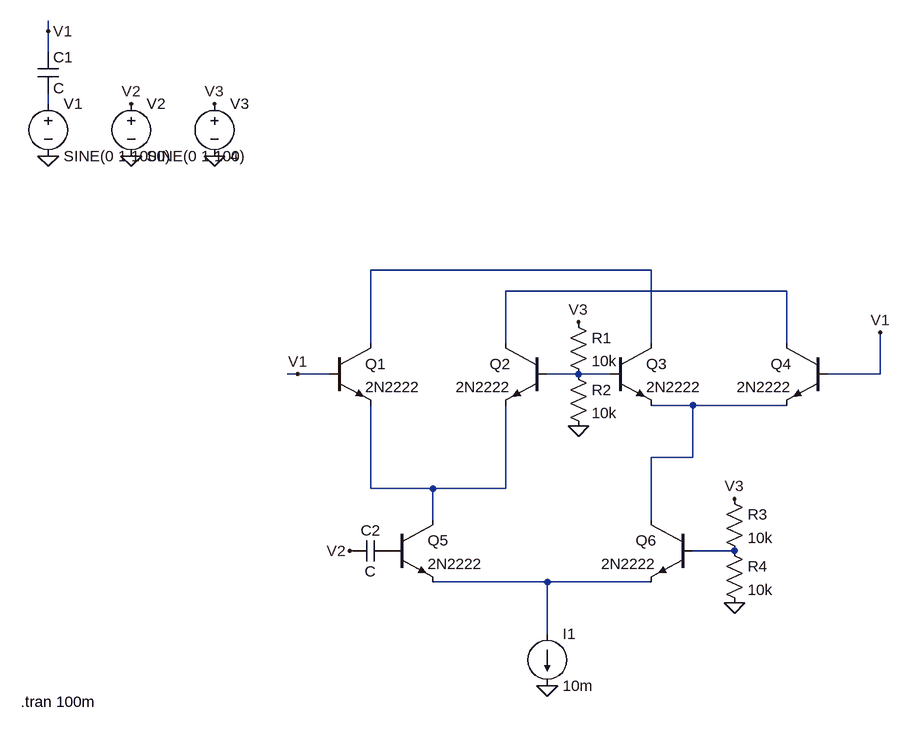
[diagram p0: schematic Draft3.asc]
Draft3.asc, the LTspice schematic file:
Version 4
SHEET 1 880 680
WIRE -432 -368 -432 -384
WIRE -432 -336 -432 -368
WIRE -432 -256 -432 -272
WIRE 496 0 64 0
WIRE 704 32 272 32
WIRE 64 112 64 0
WIRE 272 112 272 32
WIRE 496 112 496 0
WIRE 704 112 704 32
WIRE -48 160 -64 160
WIRE 0 160 -48 160
WIRE 384 160 336 160
WIRE 432 160 384 160
WIRE 848 160 848 96
WIRE 848 160 768 160
WIRE 560 208 496 208
WIRE 704 208 560 208
WIRE 560 288 560 208
WIRE 560 288 496 288
WIRE 64 336 64 208
WIRE 160 336 64 336
WIRE 272 336 272 208
WIRE 272 336 160 336
WIRE 160 384 160 336
WIRE 496 384 496 288
WIRE 624 432 560 432
WIRE 336 480 160 480
WIRE 496 480 336 480
WIRE 336 560 336 480
FLAG -432 -176 0
FLAG -304 -176 0
FLAG -176 -176 0
FLAG -304 -256 V2
FLAG 384 240 0
FLAG -176 -256 V3
FLAG 384 80 V3
FLAG 624 512 0
FLAG 624 352 V3
FLAG 32 432 V2
FLAG 336 640 0
FLAG -432 -368 V1
FLAG -48 160 V1
FLAG 848 96 V1
SYMBOL npn 0 112 R0
SYMATTR InstName Q1
SYMATTR Value 2N2222
SYMBOL npn 336 112 M0
SYMATTR InstName Q2
SYMATTR Value 2N2222
SYMBOL npn 432 112 R0
SYMATTR InstName Q3
SYMATTR Value 2N2222
SYMBOL npn 768 112 M0
SYMATTR InstName Q4
SYMATTR Value 2N2222
SYMBOL npn 96 384 R0
SYMATTR InstName Q5
SYMATTR Value 2N2222
SYMBOL npn 560 384 M0
SYMATTR InstName Q6
SYMATTR Value 2N2222
SYMBOL voltage -432 -272 R0
WINDOW 123 0 0 Left 0
WINDOW 39 0 0 Left 0
SYMATTR InstName V1
SYMATTR Value SINE(0 1 1000)
SYMBOL voltage -304 -272 R0
WINDOW 123 0 0 Left 0
WINDOW 39 0 0 Left 0
SYMATTR InstName V2
SYMATTR Value SINE(0 1 100)
SYMBOL voltage -176 -272 R0
WINDOW 123 0 0 Left 0
WINDOW 39 0 0 Left 0
SYMATTR InstName V3
SYMATTR Value 4
SYMBOL res 368 64 R0
SYMATTR InstName R1
SYMATTR Value 10k
SYMBOL res 368 144 R0
SYMATTR InstName R2
SYMATTR Value 10k
SYMBOL res 608 336 R0
SYMATTR InstName R3
SYMATTR Value 10k
SYMBOL res 608 416 R0
SYMATTR InstName R4
SYMATTR Value 10k
SYMBOL cap 96 416 R90
WINDOW 0 0 32 VBottom 2
WINDOW 3 32 32 VTop 2
SYMATTR InstName C2
SYMBOL current 336 560 R0
WINDOW 123 0 0 Left 0
WINDOW 39 0 0 Left 0
SYMATTR InstName I1
SYMATTR Value 10m
SYMBOL cap -448 -336 R0
SYMATTR InstName C1
TEXT -474 664 Left 2 !.tran 100m

The netlist it stands for:
* Draft3.asc
Q1 N002 V1 N006 0 2N2222
Q2 N003 N004 N006 0 2N2222
Q3 N002 N004 N005 0 2N2222
Q4 N003 V1 N005 0 2N2222
Q5 N006 P001 N008 0 2N2222
Q6 N005 N007 N008 0 2N2222
V1 N001 0 SINE(0 1 1000)
V2 V2 0 SINE(0 1 100)
V3 V3 0 4
R1 V3 N004 10k
R2 N004 0 10k
R3 V3 N007 10k
R4 N007 0 10k
C2 P001 V2 C
I1 N008 0 10m
C1 V1 N001 C
.model NPN NPN
.model PNP PNP
.lib standard.bjt
.tran 100m
.backanno
.end